# EAGLE design AudioLed (EAGLE 7.5.0)
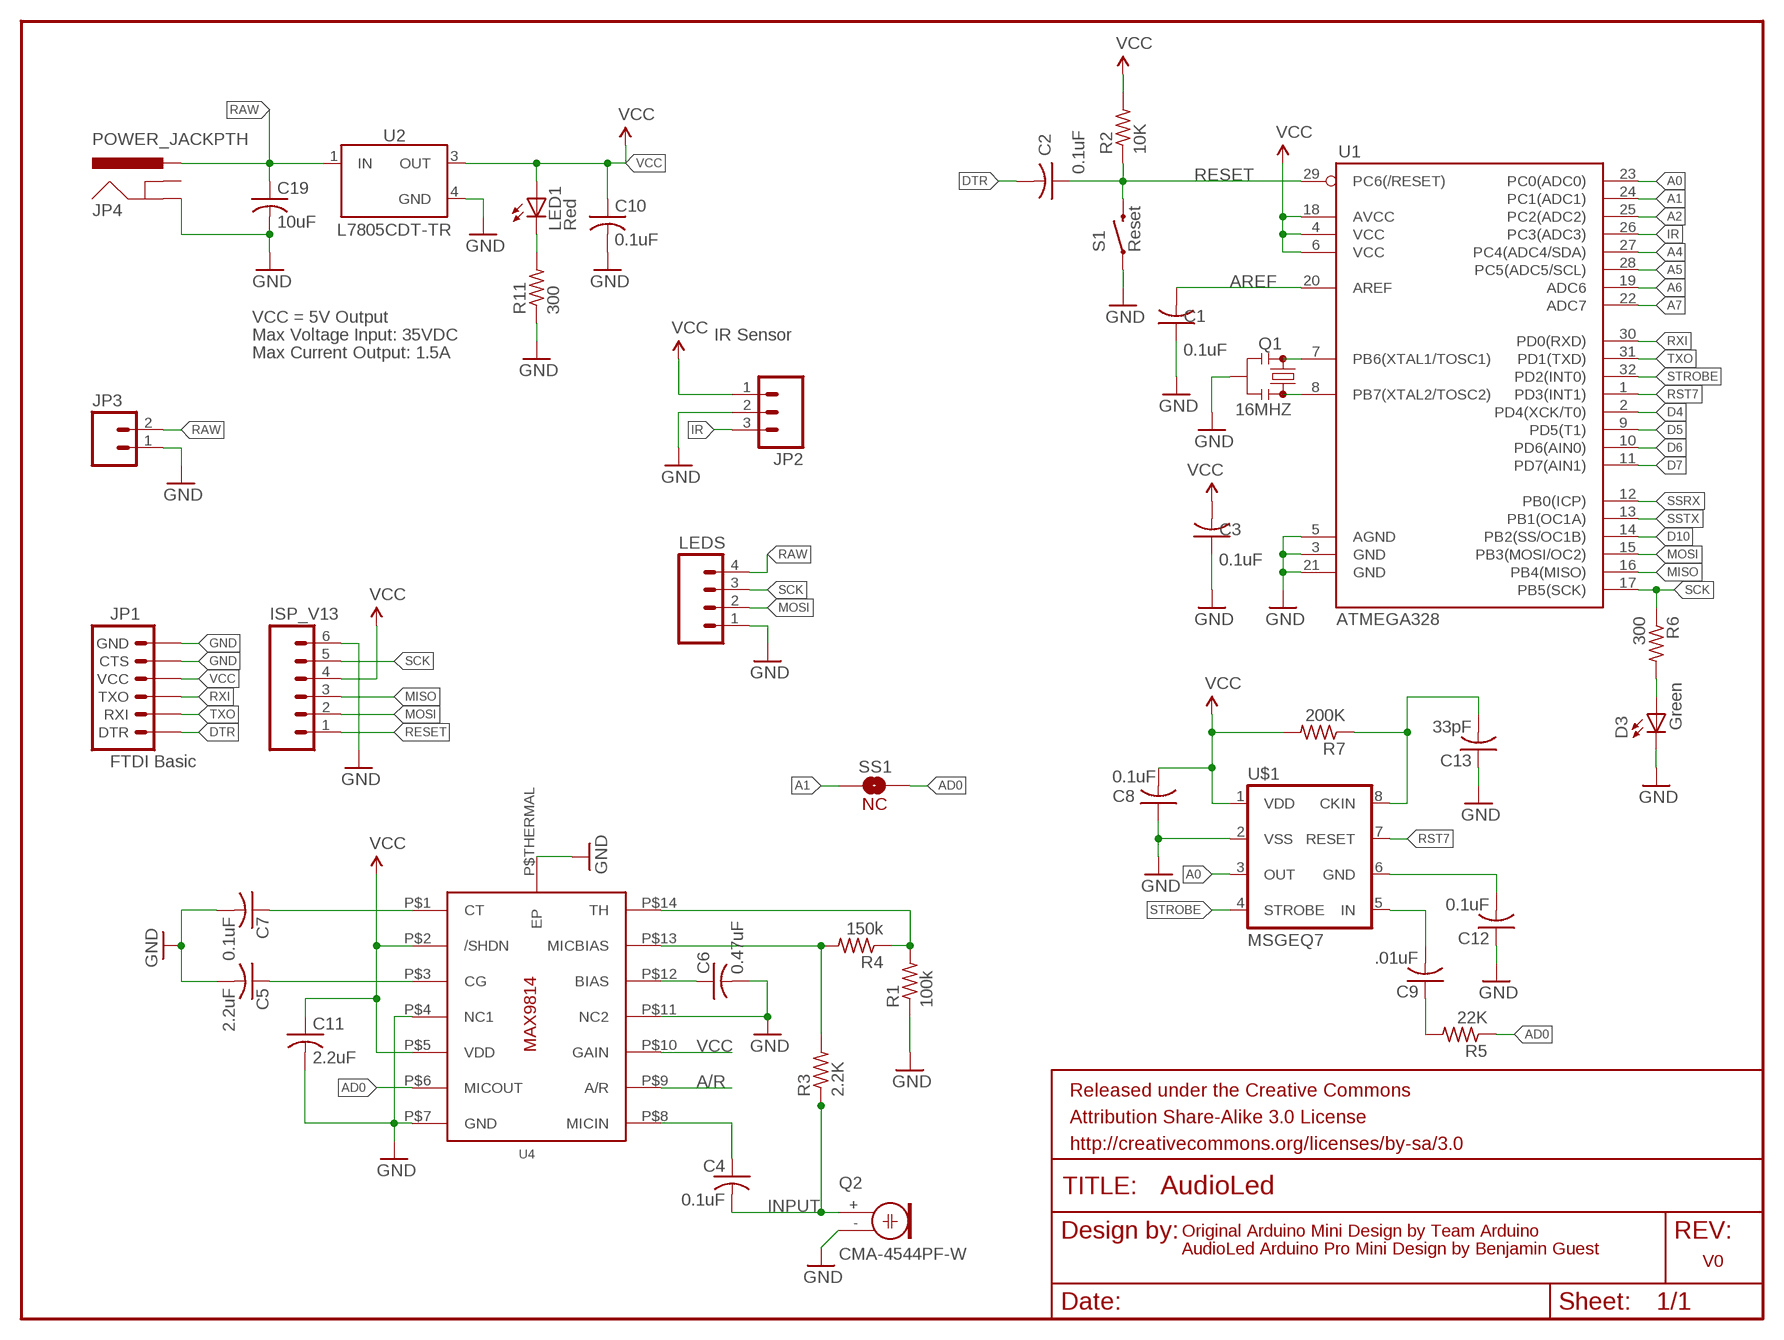
[diagram p0: schematic, sheet 1]

## Parts
C1  0.1uF  C-USC0805  [C0805]
C2  0.1uF  C-USC0805  [C0805]
C3  0.1uF  C-USC0805  [C0805]
C4  0.1uF  C-USC0805K  [C0805K]
C5  2.2uF  C-USC0805K  [C0805K]
C6  0.47uF  C-USC0805K  [C0805K]
C7  0.1uF  C-USC0805K  [C0805K]
C8  0.1uF  C-USC0805  [C0805]
C9  .01uF  C-USC0805  [C0805]
C10  0.1uF  C-USC0805  [C0805]
C11  2.2uF  C-USC0805K  [C0805K]
C12  0.1uF  C-USC0805  [C0805]
C13  33pF  C-USC0805  [C0805]
C19  10uF  C-USC0805  [C0805]
D3  Green  LEDCHIPLED_0805  [CHIPLED_0805]
FRAME1  FRAME-LETTER  [CREATIVE_COMMONS]
ISP_V13  M06SIP  [1X06]
JP1  FTDI Basic  ARDUINO_SERIAL_PROGRAMPTH  [1X06]
JP2  M03JST-PTH  [JST-3-PTH]
JP3  M02JST-PTH-2  [JST-2-PTH]
JP4  POWER_JACKPTH  [POWER_JACK_PTH]
LED1  Red  LEDCHIPLED_0805  [CHIPLED_0805]
LEDS  M04JST-PTH  [JST-4-PTH]
Q1  16MHZ  RESONATOR16MHZ  [RESONATOR-SMD]
Q2  CMA-4544PF-W  ELECTRET  [9.7ELECTRET]
R1  100k  R-US_R0805  [R0805]
R2  10K  R-US_M0805  [M0805]
R3  2.2K  R-US_R0805  [R0805]
R4  150k  R-US_R0805  [R0805]
R5  22K  R-US_M0805  [M0805]
R6  300  R-US_M0805  [M0805]
R7  200K  R-US_M0805  [M0805]
R11  300  R-US_M0805  [M0805]
S1  Reset  SWITCH-MOMENTARY-2SMD-ALT01  [TACTILE-SWITCH-SMD-ALT01]
SS1  NC  SOLDERJUMPERNC  [SJ_2S]
U1  ATMEGA328  ATMEGA168  [TQFP32-08]
U2  L7805CDT-TR  [DPAK]
U4  MAX9814TDFN14  [TDFN14_3X3MM]
U$1  MSGEQ7  [DIL08-ROUND]

## Nets
A0: U1.23(PC0(ADC0)) U$1.3(OUT)
A1: SS1.1 U1.24(PC1(ADC1))
A2: U1.25(PC2(ADC2))
A4: U1.27(PC4(ADC4/SDA))
A5: U1.28(PC5(ADC5/SCL))
A6: U1.19(ADC6)
A7: U1.22(ADC7)
A/R: U4.P$9(A/R)
AD0: R5.1 SS1.2 U4.P$6(MICOUT)
AREF: C1.2 U1.20(AREF)
D4: U1.2(PD4(XCK/T0))
D5: U1.9(PD5(T1))
D6: U1.10(PD6(AIN0))
D7: U1.11(PD7(AIN1))
D10: U1.14(PB2(SS/OC1B))
DTR: C2.2 JP1.1(DTR)
GND [raw]: C1.1 C3.1 C5.2 C6.2 C7.2 C8.1 C10.2 C11.2 C12.1 C13.1 C19.2 D3.C ISP_V13.6 JP1.5(CTS) JP1.6(GND) JP2.2 JP3.1 JP4.GND LEDS.1 Q1.2 Q2.- R1.1 R11.1 S1.1 S1.2 U1.3(GND) U1.5(AGND) U1.21(GND) U2.4(GND) U4.P$4(NC1) U4.P$7(GND) U4.P$11(NC2) U4.P$THERMAL(EP) U$1.2(VSS)
INPUT: C4.2 Q2.+ R3.1
IR: JP2.3 U1.26(PC3(ADC3))
MISO: ISP_V13.3 U1.16(PB4(MISO))
MOSI: ISP_V13.2 LEDS.2 U1.15(PB3(MOSI/OC2))
N$1: Q1.3 U1.8(PB7(XTAL2/TOSC2))
N$2: Q1.1 U1.7(PB6(XTAL1/TOSC1))
N$3: C6.1 U4.P$12(BIAS)
N$4: LED1.C R11.2
N$5: C4.1 U4.P$8(MICIN)
N$6: C9.1 R5.2
N$7: D3.A R6.2
N$8: C7.1 U4.P$1(CT)
N$9: C5.1 U4.P$3(CG)
N$10: R1.2 R4.1 U4.P$14(TH)
N$11: R3.2 R4.2 U4.P$13(MICBIAS)
N$12: C9.2 U$1.5(IN)
N$16: C12.2 U$1.6(GND)
N$18: C13.2 R7.1 U$1.8(CKIN)
RAW [raw]: C19.1 JP3.2 JP4.PWR LEDS.4 U2.1(IN)
RESET: C2.1 ISP_V13.1 R2.1 S1.3 S1.4 U1.29(PC6(/RESET))
RST7: U1.1(PD3(INT1)) U$1.7(RESET)
RXI: JP1.3(TXO) U1.30(PD0(RXD))
SCK: ISP_V13.5 LEDS.3 R6.1 U1.17(PB5(SCK))
SSRX: U1.12(PB0(ICP))
SSTX: U1.13(PB1(OC1A))
STROBE: U1.32(PD2(INT0)) U$1.4(STROBE)
TXO: JP1.2(RXI) U1.31(PD1(TXD))
VCC [vcc]: C3.2 C8.2 C10.1 C11.1 ISP_V13.4 JP1.4(VCC) JP2.1 LED1.A R2.2 R7.2 U1.4(VCC) U1.6(VCC) U1.18(AVCC) U2.3(OUT) U4.P$2(/SHDN) U4.P$5(VDD) U4.P$10(GAIN) U$1.1(VDD)
Unconnected: JP4.GNDBREAK

## Notes on the sheet
- VCC = 5V Output
- Max Voltage Input: 35VDC | IR Sensor
- Max Current Output: 1.5A
- NC
- Original Arduino Mini Design by Team Arduino
- AudioLed Arduino Pro Mini Design by Benjamin Guest
- V0

## Library data of the parts
C1-C13 C19 = adafruit:C-US: CAPACITOR, American symbol
D3 LED1 = adafruit:LED: LED OSRAM: - CHIPLED LG R971, LG N971, LY N971, LG Q971, LY Q971, LO R971, LY R971 LH N974, LH R974 LS Q976, LO Q976, LY Q976 LO Q996 - Hyper CHIPLED LW Q18S LB Q993, LB Q99A, LB R99A - SideLED LS A670, LO A670, LY A670, LG A670, LP A670 LB A673, LV A673, LT A673, LW A673 LH A674 LY A675 LS A676, LA A676, LO A676, LY A676, LW A676 LS A679, LY A679, LG A679 - Hyper Micro SIDELED® LS Y876, LA Y876, LO Y876, LY Y876 LT Y87S - SmartLED LW L88C, LW L88S LB L89C, LB L89S, LG L890 LS L89K, LO L89K, LY L89K LS L896, LA L896, LO L896, LY L896 - TOPLED LS T670, LO T670, LY T670, LG T670, LP T670 LSG T670, LSP T670, LSY T670, LOP T670, LYG T670 LG T671, LOG T671, LSG T671 LB T673, LV T673, LT T673, LW T673 LH T674 LS T676, LA T676, LO T676, LY T676, LB T676, LH T676, LSB T676, LW T676 LB T67C, LV T67C, LT T67C, LS T67K, LO T67K, LY T67K, LW E67C LS E67B, LA E67B, LO E67B, LY E67B, LB E67C, LV E67C, LT E67C LW T67C LS T679, LY T679, LG T679 LS T770, LO T770, LY T770, LG T770, LP T770 LB T773, LV T773, LT T773, LW T773 LH T774 LS E675, LA E675, LY E675, LS T675 LS T776, LA T776, LO T776, LY T776, LB T776 LHGB T686 LT T68C, LB T68C - Hyper Mini TOPLED® LB M676 - Mini TOPLED Santana® LG M470 LS M47K, LO M47K, LY M47K Source: http://www.osram.convergy.de/
FRAME1 = SparkFun-Aesthetics:FRAME-LETTER: Schematic Frame Standard 8.5x11 US Letter frame
ISP_V13 = SparkFun-Connectors:M06: Header 6 Standard 6-pin 0.1" header. Use with straight break away headers (SKU : PRT-00116), right angle break away headers (PRT-00553), swiss pins (PRT-00743), machine pins (PRT-00117), and female headers (PRT-00115). Molex polarized connector foot print use with SKU : PRT-08094 with associated crimp pins and housings. NOTES ON THE VARIANTS LOCK and LOCK_LONGPADS... This footprint was designed to help hold the alignment of a through-hole component (i.e. 6-pin header) while soldering it into place. You may notice that each hole has been shifted either up or down by 0.005 of an inch from it's more standard position (which is a perfectly straight line). This slight alteration caused the pins (the squares in the middle) to touch the edges of the holes. Because they are alternating, it causes a "brace" to hold the component in place. 0.005 has proven to be the perfect amount of "off-center" position when using our standard breakaway headers. Although looks a little odd when you look at the bare footprint, once you have a header in there, the alteration is very hard to notice. Also, if you push a header all the way into place, it is covered up entirely on the bottom side. This idea of altering the position of holes to aid alignment will be further integrated into the Sparkfun Library for other footprints. It can help hold any component with 3 or more connection pins.
JP1 = SparkFun:ARDUINO_SERIAL_PROGRAM
JP2 = SparkFun-Connectors:M03: Header 3 Standard 3-pin 0.1" header. Use with straight break away headers (SKU : PRT-00116), right angle break away headers (PRT-00553), swiss pins (PRT-00743), machine pins (PRT-00117), and female headers (PRT-00115). Molex polarized connector foot print use with SKU : PRT-08232 with associated crimp pins and housings.; SKU: PRT-09915
JP3 = SparkFun-Connectors:M02: Standard 2-pin 0.1" header. Use with - straight break away headers ( PRT-00116) - right angle break away headers (PRT-00553) - swiss pins (PRT-00743) - machine pins (PRT-00117) - female headers (PRT-00115) Molex polarized connector foot print use with: PRT-08233 with associated crimp pins and housings. 2.54_SCREWTERM for use with PRT-10571. 3.5mm Screw Terminal footprints for PRT-08084 5mm Screw Terminal footprints for use with PRT-08432; PROD_ID: CONN-09863; SKU: PRT-09914
JP4 = SparkFun-Connectors:POWER_JACK: Power Jack This is the standard 5.5mm barrel jack for power. The PTH is the most common, proven, reliable, footprint. The Slot footprint only works if the mill layer is transmitted to the PCB fab house so be warned. Mating wall wart : TOL-00298 (and others); PROD_ID: CONN-08197
LEDS = SparkFun-Connectors:M04: Header 4 Standard 4-pin 0.1" header. Use with straight break away headers (SKU : PRT-00116), right angle break away headers (PRT-00553), swiss pins (PRT-00743), machine pins (PRT-00117), and female headers (PRT-00115). Molex polarized connector foot print use with SKU : PRT-08231 with associated crimp pins and housings. 1MM SMD Version SKU: PRT-10208; SKU: PRT-09916
Q1 = SparkFun-FreqCtrl:RESONATOR: Resonator Small SMD resonator. Used, eg, on the Arduino Pro/ Pro Mini boards. 8MHz- XTAL-08895 16MHz- XTAL-08900; PROD_ID: XTAL-08900
Q2 = adafruit:ELECTRET: Electret microphone Thru hole 2.54mm spacing with 9.7mm diameter
R1-R7 R11 = adafruit:R-US_: RESISTOR, American symbol
S1 = Testing:SWITCH-MOMENTARY-2: Various NO switches- pushbuttons, reed, etc
SS1 = SparkFun-Passives:SOLDERJUMPER: Solder Jumper Standard SMD solder jumper. Used to automate production. Two varients : Normally Open and Normally Closed are the same, but have different paste layers. NC will have a large amount of paste and should jumper during reflow.
U1 = SparkFun:ATMEGA168
U2 = BAG:L7805CDT-TR: Description The L78 series of three-terminal positive regulators is available in TO-220, TO-220FP, D²PAK and DPAK packages and several fixed output voltages, making it useful in a wide range of applications. These regulators can provide local on-card regulation, eliminating the distribution problems associated with single point regulation. Each type embeds internal current limiting, thermal shutdown and safe area protection, making it essentially indestructible. If adequate heat sinking is provided, they can deliver over 1 A output current. Although designed primarily as fixed voltage regulators, these devices can be used with external components to obtain adjustable voltage and currents.
U4 = adafruit:MAX9814
U$1 = bg_eagle_lib:MSGEQ7: The seven band graphic equalizer IC is a CMOS chip that divides the audio spectrum into seven bands, 63Hz, 160Hz, 400Hz, 1kHz, 2.5kHz, 6.25kHz and 16kHz. The seven frequencies are peak detected and multiplexed to the output to provide a DC representation of the amplitude of each band. No external components are needed to select the filter responses. Only an off chip resistor and capacitor are needed to select the on chip clock oscillator frequency. The filter center frequencies track this frequency

## Net classes
0 default: width 0.254 mm, drill 0.381 mm, clearance 0.254 mm
1 raw: width 0.508 mm, drill 0.381 mm, clearance 0.254 mm
2 vcc: width 0.508 mm, drill 0.381 mm, clearance 0.254 mm

## Board
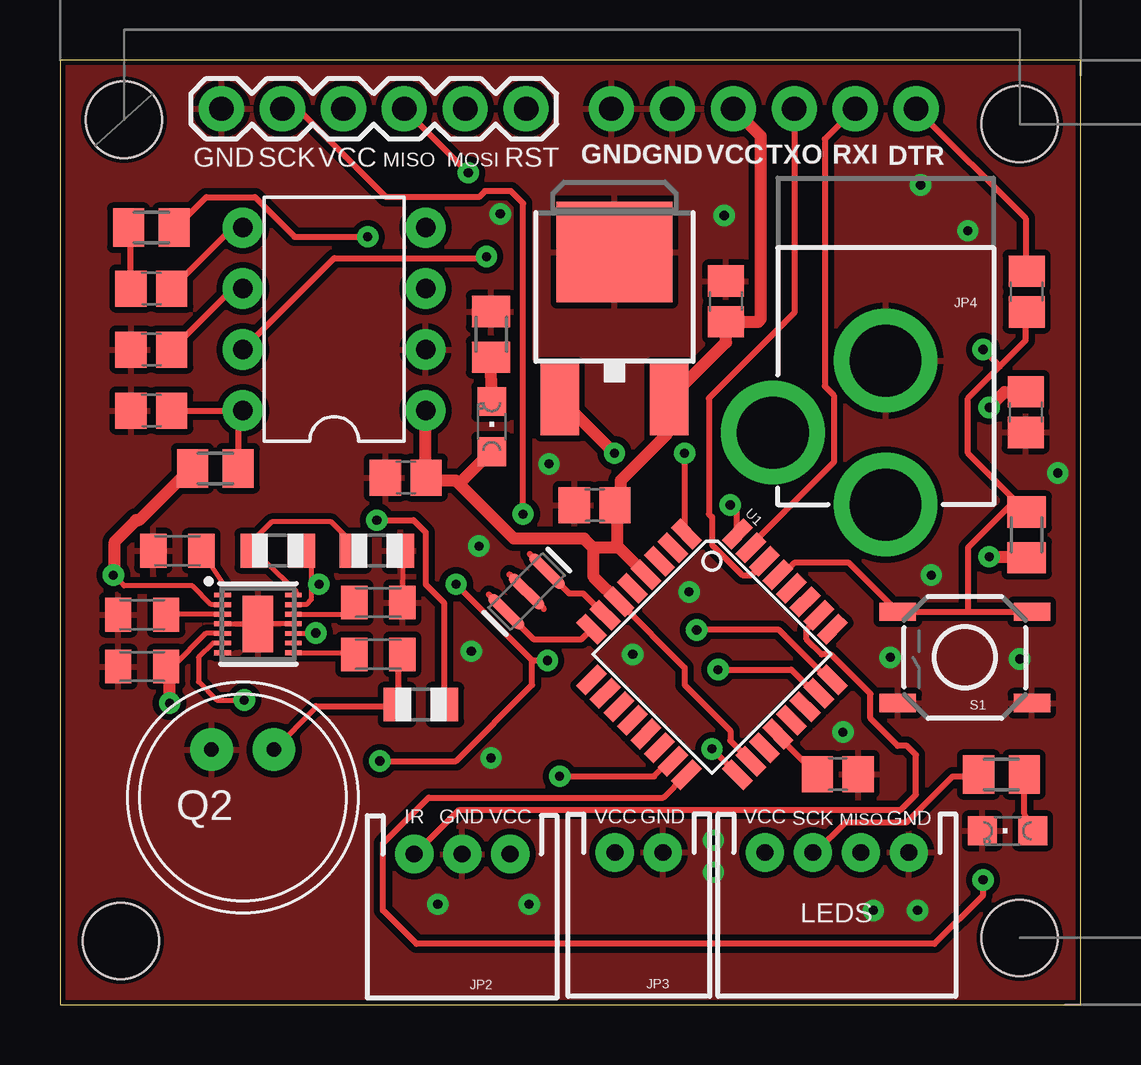
[diagram p1: board, top side]
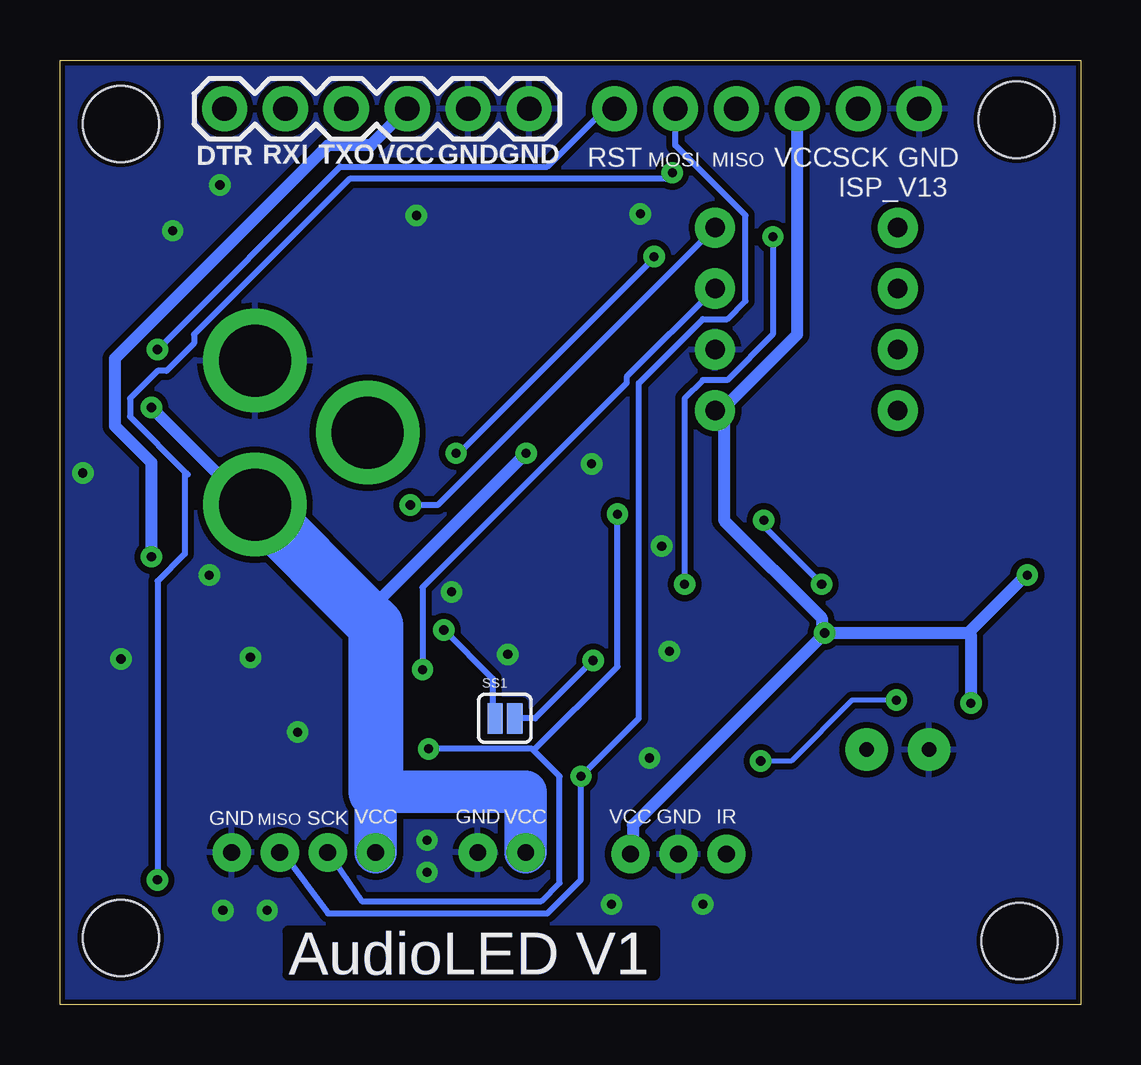
[diagram p2: board, bottom side, seen from below]

Size 42.55 x 39.37 mm. Coordinates in mm from the lower left corner, seen from the top.
Outline: 0,39.37 0,0 42.55,0 42.55,39.37 0,39.37
Copper layers (1*16): Top 0.035mm / dielectric 1.5mm / Bottom 0.035mm
Design rules "SparkFun-2-layer *": minimum track width 8mil, minimum drill 15mil, track to track 8mil, track to pad 8mil, pad to pad 8mil, via to via 8mil, smd to smd 8mil, copper to edge 8mil, drill to drill 8mil, minimum pad ring 12mil, minimum via ring 10mil, stop-mask expansion 4mil, vias tented up to drill 20mil, thermal gap 10mil
Holes 3.17 mm at 40.01,2.79 2.54,2.67 2.67,36.88 40.01,36.7

### Footprints (pad centres in the part's own frame; a part is rotated, then mirrored left to right if it is on the bottom)
C0805 = smd 1.3 x 1.5: 1 -0.85,0; 2 0.85,0
C0805K = smd 1.1 x 1.4: 1 -1,0; 2 1,0
CHIPLED_0805 = smd 1.2 x 1.2: A 0,-1.05; C 0,1.05
1X06 = drill 1.016 pad 1.88: 1 0,0; 2 2.54,0; 3 5.08,0; 4 7.62,0; 5 10.16,0; 6 12.7,0
JST-3-PTH = drill 0.7 pad 1.6: 1 -2,0; 2 0,0; 3 2,0
JST-2-PTH = drill 0.7 pad 1.6: 1 -1,0; 2 1,0
POWER_JACK_PTH = drill 2.997 pad 4.318: GND 0,7.7; GNDBREAK 4.7,10.7; PWR 0,13.7
JST-4-PTH = drill 0.7 pad 1.6: 1 -3,0; 2 -1,0; 3 1,0; 4 3,0
RESONATOR-SMD = smd 0.45 x 1.905: 1 -1.2,0; 2 0,0; 3 1.2,0
9.7ELECTRET = drill 0.6 pad 1.778: + 1.3,2; - -1.3,2
R0805 = smd 1.1 x 1.4: 1 -1,0; 2 1,0
M0805 = smd 1.3 x 1.6: 1 -0.95,0; 2 0.95,0
TACTILE-SWITCH-SMD-ALT01 = smd 1.524 x 0.762: 1 -2.794,1.905; 2 2.794,1.905; 3 -2.794,-1.905; 4 2.794,-1.905
SJ_2S = smd 0.635 x 1.27: 1 -0.412,0; 2 0.412,0
TQFP32-08 = smd 1.27 x 0.559: 1 -4.293,2.8; 2 -4.293,2; 3 -4.293,1.2; 4 -4.293,0.4; 5 -4.293,-0.4; 6 -4.293,-1.2; 7 -4.293,-2; 8 -4.293,-2.8; 17 4.293,-2.8; 18 4.293,-2; 19 4.293,-1.2; 20 4.293,-0.4; 21 4.293,0.4; 22 4.293,1.2; 23 4.293,2; 24 4.293,2.8 | smd 0.559 x 1.27: 9 -2.8,-4.293; 10 -2,-4.293; 11 -1.2,-4.293; 12 -0.4,-4.293; 13 0.4,-4.293; 14 1.2,-4.293; 15 2,-4.293; 16 2.8,-4.293; 25 2.8,4.293; 26 2,4.293; 27 1.2,4.293; 28 0.4,4.293; 29 -0.4,4.293; 30 -1.2,4.293; 31 -2,4.293; 32 -2.8,4.293
DPAK = smd 1.6 x 3: 1 -2.28,-4.04; 3 2.28,-4.04 | smd 4.826 x 4.191: 4 0,2.096
TDFN14_3X3MM = smd 0.7 x 0.2: P$1 -1.475,1.2; P$2 -1.475,0.8; P$3 -1.475,0.4; P$4 -1.475,0; P$5 -1.475,-0.4; P$6 -1.475,-0.8; P$7 -1.475,-1.2; P$8 1.475,-1.2; P$9 1.475,-0.8; P$10 1.475,-0.4; P$11 1.475,0; P$12 1.475,0.4; P$13 1.475,0.8; P$14 1.475,1.2 | smd 1.27 x 2.35: P$THERMAL 0,0
DIL08-ROUND = drill 0.813 pad 1.676: 1 -3.81,3.81; 2 -3.81,1.27; 3 -3.81,-1.27; 4 -3.81,-3.81; 5 3.81,-3.81; 6 3.81,-1.27; 7 3.81,1.27; 8 3.81,3.81

### Placement (x,y rotation side)
C1  32.42,9.61 180 top
C2  40.3,29.72 90 top
C3  22.29,20.83 0 top
C4  13.27,14.61 0 top
C5  3.43,16.26 180 top
C6  13.27,16.76 0 top
C7  4.89,18.92 180 top
C8  14.41,21.97 0 top
C9  3.81,29.84 0 top
C10  27.76,29.31 90 top
C11  3.43,14.1 180 top
C12  3.81,27.3 0 top
C13  3.81,24.77 0 top
C19  40.26,24.7 270 top
D3  39.5,7.25 90 top
FRAME1  0.53,-8.89 0 top  (outside the outline)
ISP_V13  19.43,37.34 180 top
JP1  35.69,37.34 0 bottom
JP2  16.76,6.29 180 top
JP3  24.13,6.35 180 top
JP4  34.42,34.54 180 top
LED1  18,24.09 0 top
LEDS  32.38,6.35 180 top
Q1  19.45,17.22 225 top
Q2  7.62,8.64 0 top
R1  13.21,18.92 180 top
R2  40.3,19.58 270 top
R3  15.05,12.51 0 top
R4  9.08,18.92 0 top
R5  3.81,32.38 180 top
R6  39.24,9.6 0 top
R7  6.48,22.35 180 top
R11  17.97,27.94 270 top
S1  37.72,14.48 180 top
SS1  24,11.94 0 bottom
U1  27.18,14.61 315 top
U2  23.11,29.27 0 top
U4  8.26,15.88 0 top
U$1  11.43,28.57 180 top

### Tracks (layer width: path | path; a pad name or v marks a point on that pad's centre or on a via)
A0  (via drill 0.38)
  Top 0.254: v27.43,13.97 30.48,13.97 31.37,13.08 31.62,13.08 U1.23
  Bottom 0.254: v27.43,13.97 27.43,17.4 18.92,25.91 18.92,26.16 U$1.3
A1  (via drill 0.38)
  Top 0.254: v26.54,15.62 29.97,15.62 32.13,13.46 U1.24
  Bottom 0.254: v26.54,15.62 24.51,13.59 24.51,11.94 SS1.1
AD0  (via drill 0.38)
  Top 0.203: U4.P$6 6.38,15.07 5.78,14.48 5.78,13.46 6.54,12.7 v7.68,12.7
  Top 0.254: 19.68,14.35 v20.32,14.35 | v16.51,17.53 19.68,14.35 | v12.83,32 9.78,32 8.13,33.66 6.1,33.66 4.83,32.38 R5.1 | v13.34,10.16 16.51,10.16 19.68,13.34 19.68,14.35
  Bottom 0.203: 7.62,12.7 v7.68,12.7 9.53,12.7 12.06,10.16 v13.34,10.16
  Bottom 0.254: v16.51,17.53 16.51,25.27 15.75,26.04 14.73,26.04 12.83,27.94 v12.83,32 | SS1.2 22.73,11.94 v20.32,14.35
AREF
  Top 0.254: U1.20 29.97,11.18 31.5,9.65 C1.2
DTR
  Top 0.254: JP1.1 40.26,32.77 40.26,30.61 C2.2
GND  (via drill 0.38)
  Top 0.203: U4.P$4 U4.P$THERMAL U4.P$11 | R1.1 14.27,18.86 C6.2
  Bottom 0.508: JP4.GND 34.42,26.74
  other vias: 32.64,11.37 34.61,14.48 26.23,17.21 23.88,14.61 27.69,32.89 18.35,32.96 15.75,4.19 19.56,4.19 27.24,5.52 33.91,3.94 41.59,22.16 37.85,32.26 35.88,34.16 20.38,22.54 17.46,19.11 17.14,14.73 17.97,10.29 27.24,6.86 40.01,14.41 35.75,3.94 36.32,17.91
  pour Top: 0,39.37 0,0 42.55,0 42.55,39.37
  pour Bottom: 0,39.37 0,0 42.55,0 42.55,39.37
INPUT
  Top 0.203: 10.67,12.38 Q2.+
  Top 0.254: C4.2 14.22,14.61 14.1,14.48 14.1,12.57 R3.1 13.97,12.45 10.67,12.45 10.67,12.38
IR
  Top 0.254: U1.26 31.62,16.13 31.11,15.62 31.11,15.24 31.75,14.61 32.13,14.61 33.78,12.95 33.78,11.94 34.92,10.79 35.31,10.79 35.69,10.41 35.69,8.76 35.05,8.13 16.64,8.13 14.86,6.35 JP2.3
MISO  (via drill 0.38)
  Top 0.254: ISP_V13.3 v17.02,34.67 | U1.16 26.04,9.53 25.15,8.64 15.37,8.64 13.46,6.73 13.46,3.94 14.86,2.54 36.45,2.54 38.48,4.57 v38.48,5.21
  Bottom 0.254: 37.27,22.16 39.62,24.51 39.62,25.27 38.48,26.42 38.1,26.42 36.96,27.56 36.96,27.94 30.48,34.42 17.27,34.42 v17.02,34.67 | 37.27,22.16 37.21,22.1 | v38.48,5.21 38.48,17.65 37.34,18.8 37.34,22.1 37.27,22.16
MOSI  (via drill 0.38)
  Top 0.254: v20.83,9.53 24.77,9.53 25.27,10.03 25.53,10.03 U1.15
  Bottom 0.254: LEDS.2 33.27,6.35 31.37,3.81 22.23,3.81 20.83,5.21 v20.83,9.53 18.41,11.94 18.41,25.91 15.75,28.57 14.73,28.57 13.97,29.34 13.97,32.89 16.89,35.81 ISP_V13.2
N$1
  Top 0.254: 19.32,15.66 19.74,15.24 21.74,15.24 U1.8
N$2
  Top 0.254: 21.02,17.35 21.23,17.14 21.81,17.14 U1.7
N$3
  Top 0.203: U4.P$12 11.78,16.27 C6.1
N$4
  Top 0.508: LED1.C 17.97,27.07 R11.2
N$5
  Top 0.203: U4.P$8 12.2,14.68 C4.1
N$6
  Top 0.254: C9.1 2.92,29.84 2.92,32.38 R5.2
N$7
  Top 0.254: D3.A 40.19,7.99 R6.2
N$8
  Top 0.203: U4.P$1 6.78,17.59 C7.1
N$9
  Top 0.203: U4.P$3 4.19,16.27 C5.1
N$10
  Top 0.203: U4.P$14 9.86,17.2 R4.1 8.08,19.38 8.83,20.13 11.3,20.13 12.21,19.22 R1.2
N$11  (via drill 0.38)
  Top 0.203: R4.2 10.48,18.53 10.48,17.53 10.48,16.89 10.26,16.68 U4.P$13
  Top 0.254: v13.21,20.19 14.73,20.19 15.24,19.68 15.24,17.53 16,16.76 16,12.57 R3.2 | 10.48,17.53 v10.79,17.53
  Bottom 0.254: v13.21,20.19 13.21,19.94 v10.79,17.53
N$12
  Top 0.254: C9.2 7.2,32.38 U$1.5
N$16
  Top 0.254: C12.2 7.2,29.84 U$1.6
N$18
  Top 0.254: C13.2 U$1.8 7.43,24.57 R7.1
RAW  (via drill 0.38)
  Top 0.508: v38.73,24.89 39.37,25.53 40.26,25.53 C19.1 | v23.11,22.99 20.95,25.15 U2.1
  Bottom 0.508: v38.73,24.89 35.31,21.46 JP4.PWR | 29.84,16.26 v23.11,22.99
  Bottom 1.778: LEDS.4 29.39,8.89 23.13,8.89 JP3.2
  Bottom 2.286: JP4.PWR 29.84,16.26 29.39,15.81 29.39,8.89
RESET  (via drill 0.38)
  Top 0.254: U1.29 29.97,18.03 30.23,18.03 30.61,18.41 32.89,18.41 S1.4 37.85,16.38 | 37.85,16.38 S1.3 | 39.18,26.61 37.85,25.27 37.85,22.99 40.26,20.57 R2.1 39.75,20.95 37.85,19.05 37.85,16.38 | 39.18,26.61 40.26,27.69 40.26,28.83 C2.1 | 39.18,26.61 v38.48,27.3
  Bottom 0.254: ISP_V13.1 19.81,37.34 22.23,34.92 30.86,34.92 v38.48,27.3
RST7  (via drill 0.38)
  Top 0.254: v26.04,22.99 26.04,19.68 U1.1 | U$1.7 11.43,31.11 17.78,31.11 v17.78,31.18
  Bottom 0.254: v26.04,22.99 26.04,23.11 25.78,23.11 17.78,31.11 v17.78,31.18
RXI
  Top 0.254: JP1.3 30.61,28.83 27.05,25.27 27.05,20.45 27.18,20.32 27.18,19.18 28.45,17.91 28.83,17.91 29.34,18.41 U1.30
SCK  (via drill 0.38)
  Top 0.254: v27.18,10.67 28.19,9.65 U1.17 | R6.1 38.23,9.53 37.21,9.53 35.31,7.62 32.77,7.62 31.5,6.35 LEDS.3 | ISP_V13.5 9.91,37.34 13.59,33.66 17.46,33.66 17.72,33.91 18.8,33.91 19.3,33.4 v19.3,20.45
  Bottom 0.254: v27.18,10.67 22.86,10.67 22.8,10.6 | 22.8,10.6 21.72,9.53 21.72,5.08 22.48,4.32 29.97,4.32 LEDS.3 | v19.3,20.45 19.3,14.1 22.8,10.6
STROBE  (via drill 0.38)
  Top 0.254: v27.94,20.83 28.19,20.57 28.19,19.68 U1.32
  Bottom 0.254: v27.94,20.83 26.8,20.83 U$1.4
TXO
  Top 0.254: JP1.2 31.88,36.07 31.88,25.78 32.26,25.4 32.26,22.61 28.83,19.18 U1.31
VCC  (via drill 0.38)
  Top 0.203: U4.P$5 6.08,15.47 4.7,14.1 4.57,14.1 | U4.P$2 6.31,16.68 5.52,17.46 2.67,17.46 v2.22,17.91 | U4.P$10 10.65,15.47 v10.67,15.49
  Top 0.254: U1.6 26.04,14.05 26.04,13.34 27.94,11.43 27.94,11.02 U1.18
  Top 0.508: 22.23,19.05 22.23,17.86 U1.6 | U1.4 23.3,19.05 23.24,19.05 | 23.24,19.05 22.23,19.05 | 25.39,23.91 U2.3 | U2.3 27.76,27.6 C10.1 29.1,28.46 29.21,28.57 29.21,36.2 JP1.4 | U$1.1 15.24,22 C8.2 15.49,21.84 16.51,21.84 16.64,21.72 | R7.2 5.46,22.35 3.3,20.19 3.17,20.19 2.29,19.3 2.29,17.91 v2.22,17.91 | v4.57,12.57 4.57,14.1 C11.1 | 16.64,21.72 18.92,19.43 21.84,19.43 22.23,19.05 | v38.73,18.67 40.26,18.67 R2.2 | 16.64,21.72 17.91,22.99 LED1.A | 23.24,19.05 23.24,20.83 C3.2 23.37,20.95 23.37,21.84 25.27,23.75 U2.3
  Bottom 0.508: 4.7,15.49 v10.67,15.49 | 4.7,15.49 2.29,17.91 v2.22,17.91 | v4.57,12.57 4.57,15.37 4.7,15.49 | v10.67,15.49 18.67,7.49 18.67,6.35 JP2.1 | ISP_V13.4 11.81,27.94 14.99,24.77 U$1.1 14.86,24.64 14.86,20.19 10.79,16.13 10.79,15.62 v10.67,15.49 | v38.73,18.67 38.73,22.61 40.26,24.13 40.26,26.92 31.37,35.81 29.59,35.81 JP1.4

### Text on the board
Bottom: AudioLED V1
tPlace: GND | DTR | GND | SCK | VCC | MISO | MOSI | RST | GND | VCC | TXO | RXI | IR | GND | VCC | VCC | GND | VCC | SCK | MISO | GND
bPlace: GND | DTR | GND | SCK | VCC | MISO | MOSI | RST | GND | VCC | TXO | RXI | IR | GND | VCC | VCC | GND | VCC | SCK | MISO | GND
bNames: AudioLED V1
Document: Valid combinations: | 168V / 3.3V Reg / 8MHz | 168 / 5V Reg / 16MHz | 168 / 5V Reg / 20MHz | Mark back accordingly
tDocu: Original Arduino Mini Design by Team Arduino / Arduino Pro Mini Design by SparkFun Electronics / Revised by Pete Lewis, CiderPress by Benjamin Guest